# Altium schematic sheet Quadrature Encoder.SchDoc
size A4
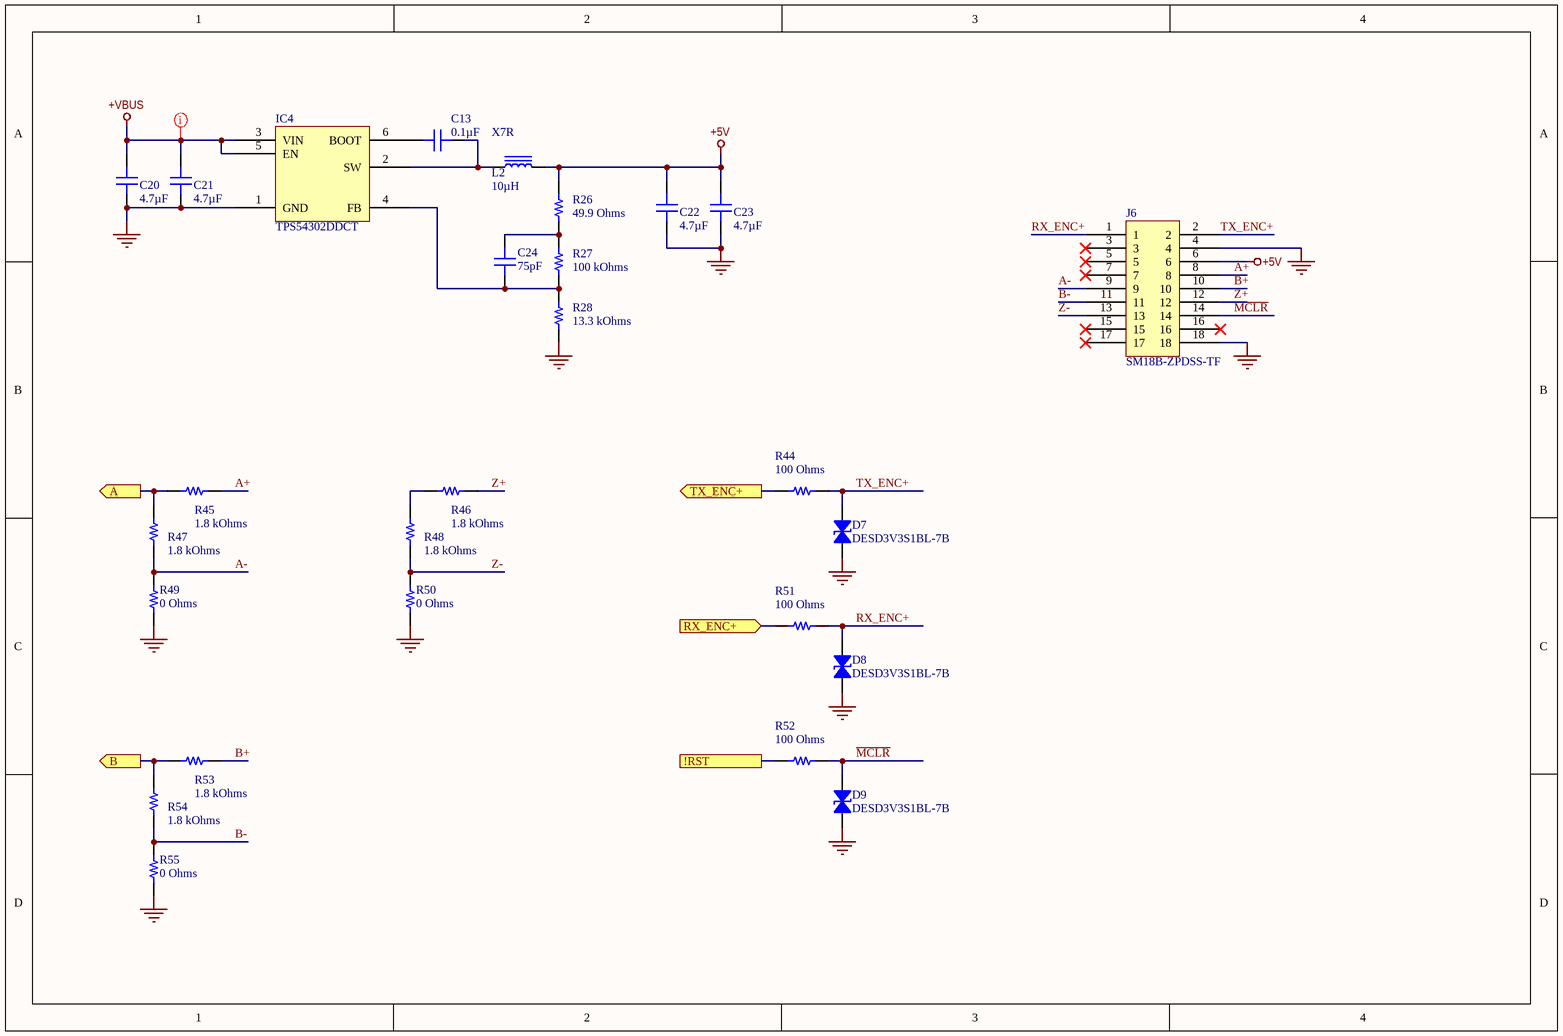
[diagram p0: Quadrature Encoder.SchDoc]

## Parts
C13  Temperature Coefficient: X7R  [CAP 0805_2012]  (hidden comment: 0.1µF)
C20  4.7µF  [CAP 1206_3216 - 1.8MM]
C21  4.7µF  [CAP 1206_3216 - 1.8MM]
C22  4.7µF  [CAP 1206_3216 - 1.8MM]
C23  4.7µF  [CAP 1206_3216 - 1.8MM]
C24  75pF  [CAP 0603_1608]
D7  DESD3V3S1BL-7B  [0402]
D8  DESD3V3S1BL-7B  [0402]
D9  DESD3V3S1BL-7B  [0402]
IC4  TPS54302DDCT  [TI SOT-23-6 DDC]
J6  SM18B-ZPDSS-TF  [SM18B-ZPDSS-TF]
L2  10µH  [IND 1008_2520]
R26  49.9 Ohms  [RES 0603_1608]
R27  100 kOhms  [RES 0603_1608]
R28  13.3 kOhms  [RES 0603_1608]
R44  100 Ohms  [RES 0603_1608]
R45  1.8 kOhms  [RES 0603_1608]
R46  1.8 kOhms  [RES 0603_1608]
R47  1.8 kOhms  [RES 0603_1608]
R48  1.8 kOhms  [RES 0603_1608]
R49  0 Ohms  [RES 0603_1608]
R50  0 Ohms  [RES 0603_1608]
R51  100 Ohms  [RES 0603_1608]
R52  100 Ohms  [RES 0603_1608]
R53  1.8 kOhms  [RES 0603_1608]
R54  1.8 kOhms  [RES 0603_1608]
R55  0 Ohms  [RES 0603_1608]

## Ports
!RST, A (out), B (out), RX_ENC+ (in), TX_ENC+ (out)

## Nets
+5V: C22.2 C23.2 J6.6 L2.2 R26.2
+VBUS: C20.2 C21.2 IC4.3(VIN) IC4.5(EN)
GND: C20.1 C21.1 C22.1 C23.1 D7.2 D8.2 D9.2 IC4.1(GND) J6.4 J6.18 R28.1 R49.1 R50.1 R55.1
!RST: R52.1 ; port !RST
~{MCLR}: D9.1 J6.14 R52.2
A: R45.1 R47.2 ; port A
A+: J6.8 R45.2
A-: J6.9 R47.1 R49.2
B: R53.1 R54.2 ; port B
B+: J6.10 R53.2
B-: J6.11 R54.1 R55.2
RX_ENC+: D8.1 J6.1 R51.2
RX_ENC+: R51.1 ; port RX_ENC+  [a separate net that carries the same name]
TX_ENC+: D7.1 J6.2 R44.2
TX_ENC+: R44.1 ; port TX_ENC+  [a separate net that carries the same name]
Z+: J6.12 R46.2
Z-: J6.13 R48.1 R50.2
NetC13_1: C13.1 IC4.6(BOOT)
NetC13_2: C13.2 IC4.2(SW) L2.1
NetC24_1: C24.1 IC4.4(FB) R27.1 R28.2
NetC24_2: C24.2 R26.1 R27.2
NetR46_1: R46.1 R48.2

Not connected (* = marked no-connect by the designer): J6 3* 5* 7* 15* 16* 17*

## Layout directives
net class HIGH_V: +VBUS

## Library data of the parts
C13 = CL21B104KBCWPNC: CAP CER 0.1UF 50V X7R 0805; Manufacturer: Samsung Electro-Mechanics; Tolerance: ±10%; Part Number: CL21B104KBCWPNC; Value: 0.1µF; Applications: Automotive; Capacitance: 0.1µF; ComponentLink1Description: Datasheet; ComponentLink1URL: http://www.samsungsem.com/kr/support/product-search/mlcc/CL21B104KBCWPNC.jsp; ComponentLink2Description: DigiKey Link; ComponentLink2URL: http://digikey.com/product-detail/en/samsung-electro-mechanics/CL21B104KBCWPNC/1276-6557-1-ND/5961416; Device Package: 0805 (2012 Metric); Features: Open Mode; LastUpdated: 8/13/2020 10:31:23 AM; Lifecycle Status: Active; Minimum Order: 1; Mounting Type: Surface Mount, MLCC; Operating Temperature: -55°C ~ 125°C; Package / Case: 0805 (2012 Metric); Packaging: TapeAndReel; PartId: 6329; Part Status: Active; Price: 0.01; Ratings: AEC-Q200; Series: CL; Size / Dimension: 0.079" L x 0.049" W (2.00mm x 1.25mm); Supplier 1: DigiKey; Supplier Part Number 1: 1276-6557-1-ND; Thickness (Max): 0.053" (1.35mm)
C20-C23 = GCM31CR71E475KA55L: CAP CER 4.7UF 25V X7R 1206; Manufacturer: Murata Electronics; Tolerance: ±10%; Part Number: GCM31CR71E475KA55L; Value: 4.7µF; Applications: Automotive; Capacitance: 4.7µF; ComponentLink1Description: Datasheet; ComponentLink1URL: https://www.murata.com/~/media/webrenewal/support/library/catalog/products/capacitor/mlcc/c03e.ashx?la=en-us; ComponentLink2Description: DigiKey Link; ComponentLink2URL: http://digikey.com/product-detail/en/murata-electronics/GCM31CR71E475KA55L/490-4794-1-ND/1641713; Device Package: 1206 (3216 Metric); LastUpdated: 9/2/2020 1:05:30 AM; Lifecycle Status: Active; Minimum Order: 1; Mounting Type: Surface Mount, MLCC; Operating Temperature: -55°C ~ 125°C; Package / Case: 1206 (3216 Metric); Packaging: TapeAndReel; PartId: 21968; Part Status: Active; Price: 0.16; Ratings: AEC-Q200; Series: GCM; Size / Dimension: 0.126" L x 0.063" W (3.20mm x 1.60mm); Supplier 1: DigiKey; Supplier Part Number 1: 490-4794-1-ND; Temperature Coefficient: X7R; Thickness (Max): 0.071" (1.80mm); Voltage - Rated: 25V
C24 = 06035A750JAT2A: CAP CER 75PF 50V NP0 0603; Manufacturer: AVX Corporation; Temperature Coefficient: C0G, NP0; Tolerance: ±5%; Part Number: 06035A750JAT2A; Value: 75pF; Applications: General Purpose; Capacitance: 75pF; ComponentLink1Description: Datasheet; ComponentLink1URL: http://datasheets.avx.com/C0GNP0-Dielectric.pdf; ComponentLink2Description: DigiKey Link; ComponentLink2URL: http://digikey.com/product-detail/en/avx-corporation/06035A750JAT2A/478-10336-1-ND/6797499; Device Package: 0603 (1608 Metric); LastUpdated: 9/2/2020 1:03:13 AM; Lifecycle Status: Active; Minimum Order: 1; Mounting Type: Surface Mount, MLCC; Operating Temperature: -55°C ~ 125°C; Package / Case: 0603 (1608 Metric); Packaging: TapeAndReel; PartId: 14290; Part Status: Active; Price: 0.01; Series: -; Size / Dimension: 0.063" L x 0.032" W (1.60mm x 0.81mm); Supplier 1: DigiKey; Supplier Part Number 1: 478-10336-1-ND; Thickness (Max): 0.035" (0.90mm); Voltage - Rated: 50V
D7-D9 = DESD3V3S1BL-7B: TVS DIODE 3.3V 7V DFN1006-2; Manufacturer: Diodes Incorporated; Bidirectional Channels: 1; Capacitance @ Frequency: 10pF @ 1MHz; Current - Peak Pulse (10/1000µs): 5A (8/20µs); Power Line Protection: No; Power - Peak Pulse: 35W; Type: Zener; Voltage - Breakdown (Min): 3.8V; Voltage - Reverse Standoff (Typ): 3.3V (Max); Part Number: DESD3V3S1BL-7B; Applications: General Purpose; ComponentLink1Description: Datasheet; ComponentLink1URL: https://www.diodes.com/assets/Datasheets/DESD3V3S1BL.pdf; ComponentLink2Description: DigiKey Link; ComponentLink2URL: http://digikey.com/product-detail/en/diodes-incorporated/DESD3V3S1BL-7B/DESD3V3S1BL-7BDICT-ND/4567799; Device Package: 0402 (1006 Metric); LastUpdated: 9/2/2020 1:28:49 AM; Lifecycle Status: Active; Minimum Order: 1; Mounting Type: Surface Mount; Operating Temperature: -65°C ~ 150°C (TJ); Package / Case: 0402 (1006 Metric); Packaging: TapeAndReel; PartId: 10451; Part Status: Active; Price: 0.04; Series: -; Supplier 1: DigiKey; Supplier Part Number 1: DESD3V3S1BL-7BDICT-ND; Supplier Device Package: X1-DFN1006-2; Voltage - Clamping (Max) @ Ipp: 7V
IC4 = TPS54302DDCT: IC REG BUCK ADJ 3A TSOT23-6; Manufacturer: Texas Instruments; Frequency - Switching: 400kHz; Function: Step-Down; Number of Outputs: 1; Output Configuration: Positive; Output Type: Adjustable; Synchronous Rectifier: Yes; Voltage - Input (Max): 28V; Voltage - Input (Min): 4.5V; Voltage - Output (Min/Fixed): 0.596V; Part Number: TPS54302DDCT; ComponentLink1Description: Datasheet; ComponentLink1URL: http://www.ti.com/general/docs/suppproductinfo.tsp?distId=10&gotoUrl=http%3A%2F%2Fwww.ti.com%2Flit%2Fgpn%2Ftps54302; ComponentLink2Description: DigiKey Link; ComponentLink2URL: http://digikey.com/product-detail/en/texas-instruments/TPS54302DDCT/296-44542-1-ND/6128450; Current - Output: 3A; Device Package: SOT-23-6 Thin, TSOT-23-6; LastUpdated: 2/4/2020 2:31:43 PM; Lifecycle Status: Active; Minimum Order: 1; Mounting Type: Surface Mount; Operating Temperature: -40°C ~ 125°C (TJ); Package / Case: SOT-23-6 Thin, TSOT-23-6; Packaging: TapeAndReel; Part Status: Active; Price: 1.06; Series: -; Supplier 1: DigiKey; Supplier Part Number 1: 296-44542-1-ND; Supplier Device Package: TSOT-23-6; Topology: Buck; Voltage - Output (Max): 28V
L2 = 1269AS-H-100N=P2: FIXED IND 10UH 1A 689 MOHM SMD; Manufacturer: Murata Electronics; DC Resistance (DCR): 689mOhm Max; Inductance Frequency - Test: 1MHz; Material - Core: Iron Powder; Shielding: Shielded; Tolerance: ±30%; Type: Wirewound; Part Number: 1269AS-H-100N=P2; ComponentLink1Description: Datasheet; ComponentLink1URL: https://search.murata.co.jp/Ceramy/image/img/P02/J(E)TE243A-0004_DFE252010C_reference.pdf; ComponentLink2Description: DigiKey Link; ComponentLink2URL: http://digikey.com/product-detail/en/murata-electronics/1269AS-H-100N=P2/490-10572-1-ND/5272028; Current Rating (Amps): 1A; Device Package: 1008 (2520 Metric); Height - Seated (Max): 0.039" (1.00mm); Inductance: 10µH; LastUpdated: 9/2/2020 1:29:15 AM; Lifecycle Status: Active; Minimum Order: 1; Mounting Type: Surface Mount; Operating Temperature: -40°C ~ 85°C; Package / Case: 1008 (2520 Metric); Packaging: TapeAndReel; PartId: 3455; Part Status: Active; Price: 0.14; Series: DFE252010C; Size / Dimension: 0.098" L x 0.079" W (2.50mm x 2.00mm); Supplier 1: DigiKey; Supplier Part Number 1: 490-10572-1-ND; Supplier Device Package: 1008 (2520 Metric); Value: 10µH
R26 = ERA-3AEB49R9V: RES SMD 49.9 OHM 0.1% 1/10W 0603; Manufacturer: Panasonic Electronic Components; Power (Watts): 0.1W, 1/10W; Temperature Coefficient: ±25ppm/°C; Part Number: ERA-3AEB49R9V; Value: 49.9 Ohms; ComponentLink1Description: Datasheet; ComponentLink1URL: https://industrial.panasonic.com/cdbs/www-data/pdf/RDM0000/AOA0000C307.pdf; ComponentLink2Description: DigiKey Link; ComponentLink2URL: http://digikey.com/product-detail/en/panasonic-electronic-components/ERA-3AEB49R9V/P49.9DBCT-ND/3075987; Composition: Thin Film; Device Package: 0603 (1608 Metric); Features: Automotive AEC-Q200; Height - Seated (Max): 0.022" (0.55mm); LastUpdated: 9/2/2020 1:10:23 AM; Lifecycle Status: Active; Minimum Order: 1; Number of Terminations: 2; Operating Temperature: -55°C ~ 155°C; Package / Case: 0603 (1608 Metric); Packaging: TapeAndReel; PartId: 5548; Part Status: Active; Price: 0.04; Ratings: AEC-Q200; Resistance: 49.9 Ohms; Series: ERA-3A; Size / Dimension: 0.063" L x 0.031" W (1.60mm x 0.80mm); Supplier 1: DigiKey; Supplier Part Number 1: P49.9DBCT-ND; Supplier Device Package: 0603; Tolerance: ±0.1%
R27 = RNCS0603BKE100K: RES 100K OHM 0.1% 1/16W 0603; Manufacturer: Stackpole Electronics Inc; Power (Watts): 0.063W, 1/16W; Temperature Coefficient: ±25ppm/°C; Part Number: RNCS0603BKE100K; Value: 100 kOhms; ComponentLink1Description: Datasheet; ComponentLink1URL: https://www.seielect.com/catalog/sei-rncs_rnch.pdf; ComponentLink2Description: DigiKey Link; ComponentLink2URL: http://digikey.com/product-detail/en/stackpole-electronics-inc/RNCS0603BKE100K/RNCS0603BKE100KCT-ND/1800112; Composition: Thin Film; Device Package: 0603 (1608 Metric); Features: Anti-Corrosive, Automotive AEC-Q200, Moisture Resistant; Height - Seated (Max): 0.022" (0.55mm); LastUpdated: 9/2/2020 1:10:25 AM; Lifecycle Status: Active; Minimum Order: 1; Number of Terminations: 2; Operating Temperature: -55°C ~ 155°C; Package / Case: 0603 (1608 Metric); Packaging: TapeAndReel; PartId: 4849; Part Status: Active; Price: 0.08; Ratings: AEC-Q200; Resistance: 100 kOhms; Series: RNCS; Size / Dimension: 0.061" L x 0.031" W (1.55mm x 0.80mm); Supplier 1: DigiKey; Supplier Part Number 1: RNCS0603BKE100KCT-ND; Supplier Device Package: 0603; Tolerance: ±0.1%
R28 = ERJ-PB3D1332V: RES SMD 13.3K OHM 0.5% 1/5W 0603; Manufacturer: Panasonic Electronic Components; Power (Watts): 0.2W, 1/5W; Temperature Coefficient: ±50ppm/°C; Part Number: ERJ-PB3D1332V; Value: 13.3 kOhms; ComponentLink1Description: Datasheet; ComponentLink1URL: https://industrial.panasonic.com/cdbs/www-data/pdf/RDM0000/AOA0000C328.pdf; ComponentLink2Description: DigiKey Link; ComponentLink2URL: http://digikey.com/product-detail/en/panasonic-electronic-components/ERJ-PB3D1332V/P20410CT-ND/6214665; Composition: Thick Film; Device Package: 0603 (1608 Metric); Features: Automotive AEC-Q200, Pulse Withstanding; Height - Seated (Max): 0.022" (0.55mm); LastUpdated: 9/2/2020 1:10:20 AM; Lifecycle Status: Active; Minimum Order: 1; Number of Terminations: 2; Operating Temperature: -55°C ~ 155°C; Package / Case: 0603 (1608 Metric); Packaging: TapeAndReel; PartId: 7081; Part Status: Active; Price: 0.02; Ratings: AEC-Q200; Resistance: 13.3 kOhms; Series: ERJ; Size / Dimension: 0.063" L x 0.031" W (1.60mm x 0.80mm); Supplier 1: DigiKey; Supplier Part Number 1: P20410CT-ND; Supplier Device Package: 0603; Tolerance: ±0.5%
R44 R51 R52 = RNCP0603FTD100R: RES 100 OHM 1% 1/8W 0603; Manufacturer: Stackpole Electronics Inc; Power (Watts): 0.125W, 1/8W; Temperature Coefficient: ±100ppm/°C; Part Number: RNCP0603FTD100R; Value: 100 Ohms; ComponentLink1Description: Datasheet; ComponentLink1URL: https://www.seielect.com/catalog/sei-rncp.pdf; ComponentLink2Description: DigiKey Link; ComponentLink2URL: http://digikey.com/product-detail/en/stackpole-electronics-inc/RNCP0603FTD100R/RNCP0603FTD100RCT-ND/2240425; Composition: Thin Film; Device Package: 0603 (1608 Metric); Features: Anti-Sulfur, Moisture Resistant; Height - Seated (Max): 0.020" (0.50mm); LastUpdated: 9/2/2020 1:10:23 AM; Lifecycle Status: Active; Minimum Order: 1; Number of Terminations: 2; Operating Temperature: -55°C ~ 155°C; Package / Case: 0603 (1608 Metric); Packaging: TapeAndReel; PartId: 5692; Part Status: Active; Price: 0.01; Resistance: 100 Ohms; Series: RNCP; Size / Dimension: 0.059" L x 0.031" W (1.50mm x 0.80mm); Supplier 1: DigiKey; Supplier Part Number 1: RNCP0603FTD100RCT-ND; Supplier Device Package: 0603; Tolerance: ±1%
R45-R48 R53 R54 = ERJ-PA3F1801V: RES SMD 1.8K OHM 1% 1/4W 0603; Manufacturer: Panasonic Electronic Components; Power (Watts): 0.25W, 1/4W; Temperature Coefficient: ±100ppm/°C; Part Number: ERJ-PA3F1801V; Value: 1.8 kOhms; ComponentLink1Description: Datasheet; ComponentLink1URL: https://industrial.panasonic.com/cdbs/www-data/pdf/RDO0000/AOA0000C331.pdf; ComponentLink2Description: DigiKey Link; ComponentLink2URL: http://digikey.com/product-detail/en/panasonic-electronic-components/ERJ-PA3F1801V/P1.8KBYCT-ND/5036145; Composition: Thick Film; Device Package: 0603 (1608 Metric); Features: Automotive AEC-Q200, Pulse Withstanding; Height - Seated (Max): 0.022" (0.55mm); LastUpdated: 8/13/2020 10:36:29 AM; Lifecycle Status: Active; Minimum Order: 1; Number of Terminations: 2; Operating Temperature: -55°C ~ 155°C; Package / Case: 0603 (1608 Metric); Packaging: TapeAndReel; PartId: 25380; Part Status: Active; Price: 0.02; Ratings: AEC-Q200; Resistance: 1.8 kOhms; Series: ERJ; Size / Dimension: 0.063" L x 0.031" W (1.60mm x 0.80mm); Supplier 1: DigiKey; Supplier Part Number 1: P1.8KBYCT-ND; Supplier Device Package: 0603; Tolerance: ±1%
R49 R50 R55 = CRCW06030000Z0EAHP: RES SMD 0 OHM JUMPER 1/4W 0603; Manufacturer: Vishay Dale; Power (Watts): 0.25W, 1/4W; Part Number: CRCW06030000Z0EAHP; Value: 0 Ohms; ComponentLink1Description: Datasheet; ComponentLink1URL: http://www.vishay.com/docs/20043/crcwhpe3.pdf; ComponentLink2Description: DigiKey Link; ComponentLink2URL: http://digikey.com/product-detail/en/vishay-dale/CRCW06030000Z0EAHP/541-0.0SBCT-ND/2222749; Composition: Thick Film; Device Package: 0603 (1608 Metric); Features: Automotive AEC-Q200, Pulse Withstanding; Height - Seated (Max): 0.022" (0.55mm); LastUpdated: 9/2/2020 1:10:23 AM; Lifecycle Status: Active; Minimum Order: 1; Number of Terminations: 2; Operating Temperature: -55°C ~ 155°C; Package / Case: 0603 (1608 Metric); Packaging: TapeAndReel; PartId: 5474; Part Status: Active; Price: 0.02; Ratings: AEC-Q200; Resistance: 0 Ohms; Series: CRCW-HP; Size / Dimension: 0.063" L x 0.033" W (1.60mm x 0.85mm); Supplier 1: DigiKey; Supplier Part Number 1: 541-0.0SBCT-ND; Supplier Device Package: 0603; Tolerance: Jumper